# Altium project ts_20-Telemtry-Unit.PrjPcb
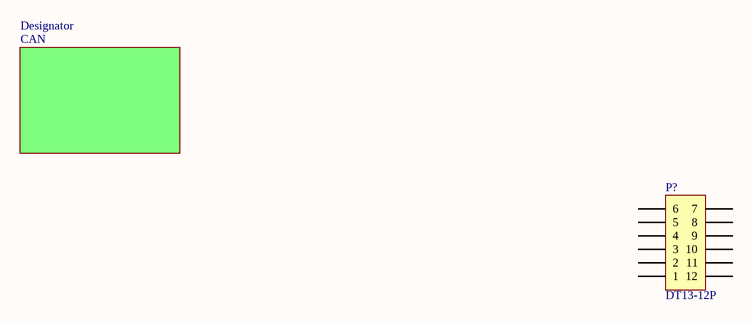
[diagram p0: Top Level.SchDoc]
2 sheets, 1 parts. Net scope: global (net labels, ports and power ports of the same name join across sheets).
Sheets:
  Top Level.SchDoc
    Designator = CAN.SchDoc

## Sheet Top Level.SchDoc
size A4; SheetNumber: 1; SheetTotal: 2

### Parts
P?  DT13-12P  [DT13-12P]

### Sub-sheets
Designator = CAN: no entries

### Nets

Not connected (* = marked no-connect by the designer): P? 1 2 3 4 5 6 7 8 9 10 11 12

### Library data of the parts
P? = DT13-12P: Positions: 12; Pitch: 4.44mm; Row Spacing: 6.35mm; Angle: 90; Flange: Yes; Contact: Nickel; Part Number: DT13-12P; Digikey Part Number: 1734-1451-ND; Digikey Link: https://www.digikey.com.au/product-detail/en/te-connectivity-deutsch-connectors/DT13-12PA/1734-1451-ND/7220123

## Sheet CAN.SchDoc
size A4; SheetNumber: 2; SheetTotal: 2